# Altium schematic sheet P13 Configuration.SchDoc
size 420 x 297 mm
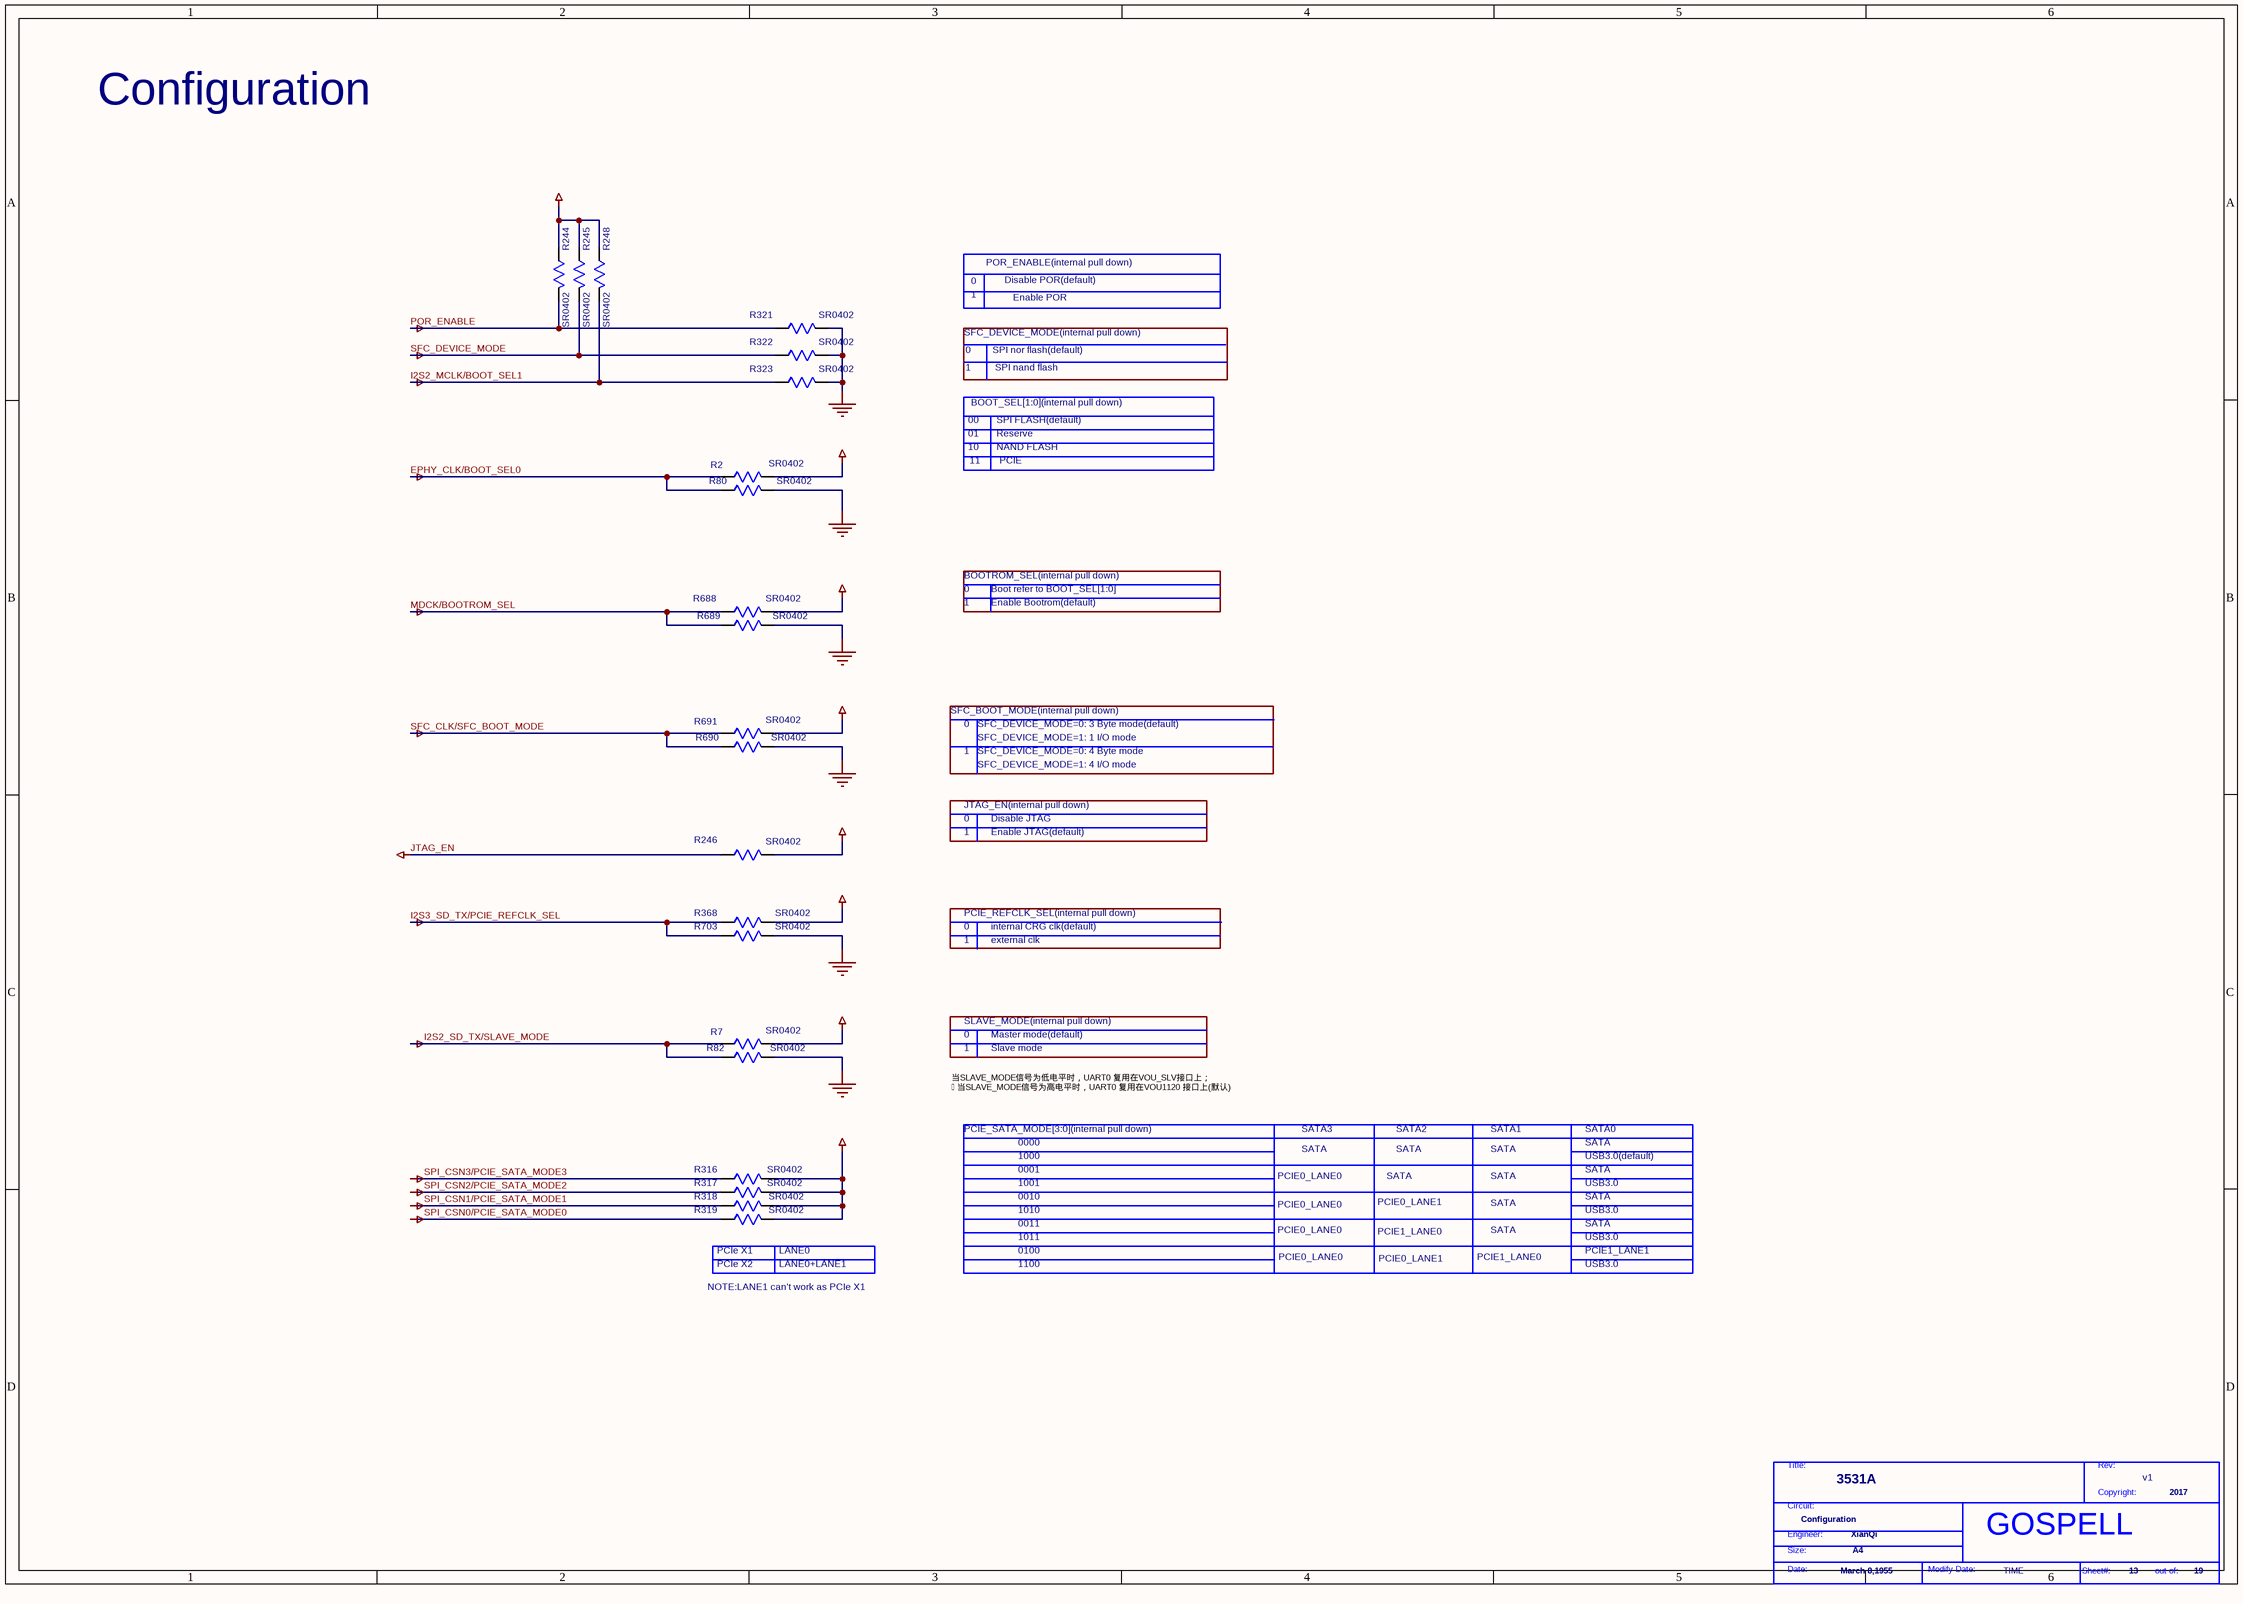
[diagram p0: P13 Configuration.SchDoc]

## Parts
*  Page Modify Date: TIME  Engineer: XianQi  Copyright: 2017  Title: 3531A  RevCode: v1  Page Size: A4  Page Create Date: March 8,1955  Page Number: 13  Page Count: 19  Doc: Configuration  (hidden comment: GOSPELL)  (graphical)
R2  SR0402  [SR0402]
R7  SR0402  [SR0402]
R80  SR0402  [SR0402]
R82  SR0402  [SR0402]
R244  SR0402  [SR0402]
R245  SR0402  [SR0402]
R246  SR0402  [SR0402]
R248  SR0402  [SR0402]
R316  SR0402  [SR0402]
R317  SR0402  [SR0402]
R318  SR0402  [SR0402]
R319  SR0402  [SR0402]
R321  SR0402  [SR0402]
R322  SR0402  [SR0402]
R323  SR0402  [SR0402]
R368  SR0402  [SR0402]
R688  SR0402  [SR0402]
R689  SR0402  [SR0402]
R690  SR0402  [SR0402]
R691  SR0402  [SR0402]
R703  SR0402  [SR0402]

## Nets
3V3: R2.2(B) R7.2(B) R244.1(A) R245.1(A) R246.2(B) R248.1(A) R316.2(B) R317.2(B) R318.2(B) R319.2(B) R368.2(B) R688.2(B) R691.2(B)
EPHY_CLK/BOOT_SEL0: R2.1(A) R80.1(A)
GND: R80.2(B) R82.2(B) R321.2(B) R322.2(B) R323.2(B) R689.2(B) R690.2(B) R703.2(B)
I2S2_MCLK/BOOT_SEL1: R248.2(B) R323.1(A)
I2S2_SD_TX/SLAVE_MODE: R7.1(A) R82.1(A)
I2S3_SD_TX/PCIE_REFCLK_SEL: R368.1(A) R703.1(A)
JTAG_EN: R246.1(A)
MDCK/BOOTROM_SEL: R688.1(A) R689.1(A)
POR_ENABLE: R244.2(B) R321.1(A)
SFC_CLK/SFC_BOOT_MODE: R690.1(A) R691.1(A)
SFC_DEVICE_MODE: R245.2(B) R322.1(A)
SPI_CSN0/PCIE_SATA_MODE0: R319.1(A)
SPI_CSN1/PCIE_SATA_MODE1: R318.1(A)
SPI_CSN2/PCIE_SATA_MODE2: R317.1(A)
SPI_CSN3/PCIE_SATA_MODE3: R316.1(A)

## Notes on the sheet
- Configuration
- 0
- 1
- POR_ENABLE(internal pull down)
- Disable POR(default)
- Enable POR
- SFC_DEVICE_MODE(internal pull down)
- SPI nor flash(default)
- SPI nand flash
- 10
- 01
- 00
- 11
- BOOT_SEL[1:0](internal pull down)
- NAND FLASH
- SPI FLASH(default)
- Reserve
- PCIE
- BOOTROM_SEL(internal pull down)
- Boot refer to BOOT_SEL[1:0]
- Enable Bootrom(default)
- SFC_BOOT_MODE(internal pull down)
- SFC_DEVICE_MODE=0: 3 Byte mode(default)
- SFC_DEVICE_MODE=1: 4 I/O mode
- SFC_DEVICE_MODE=0: 4 Byte mode
- SFC_DEVICE_MODE=1: 1 I/O mode
- JTAG_EN(internal pull down)
- Enable JTAG(default)
- Disable JTAG
- PCIE_REFCLK_SEL(internal pull down)
- internal CRG clk(default)
- external clk
- SLAVE_MODE(internal pull down)
- Slave mode
- Master mode(default)
- 当SLAVE_MODE信号为低电平时，UART0 复用在VOU_SLV接口上；
   当SLAVE_MODE信号为高电平时，UART0 复用在VOU1120 接口上(默认)
- PCIE_SATA_MODE[3:0](internal pull down)
- SATA3
- SATA2
- SATA1
- SATA0
- 1001
- 0001
- 0010
- 1000
- 0000
- PCIE0_LANE0
- SATA
- PCIE0_LANE1
- USB3.0(default)
- USB3.0
- PCIe X1
- PCIe X2
- LANE0+LANE1
- LANE0
- 1010
- 0011
- 1011
- 0100
- 1100
- PCIE1_LANE0
- PCIE1_LANE1
- NOTE:LANE1 can't work as PCIe X1
- (in symbol GOSPELL) Title:; Rev:; Copyright:; Circuit:; Engineer:; Size:; Date:; Modify Date:; Sheet#:; out of:

## Library data of the parts
R2 R80 R82 R246 R318 R319 R368 R689 R703 = R_1: PARTS: 1; LEVEL: STD; DEVICE: RK73B1ELTP472J; PINSWAP: (A,B); OriginalSymbolOrigin: (10,20); CODE: 7090793; %195%%232%%202%%246%: 片式厚膜电阻器-0.0625W-4700OHM-+/-5%-0402-BT; %182%%238%%182%%168%%185%%166%%194%%202%(W): 0.06; %215%%232%%214%%181%%212%%202%%208%%237%%198%%171%%178%%238%: +/-5%; COMPONENT_HIGH_MAX: 0.4MM; %208%%161%%192%%224%%195%%251%%179%%198%: 片式厚膜电阻器; PKG_TYPE: SR0402
R7 R316 R317 R688 R690 R691 = R_1: PARTS: 1; LEVEL: STD; DEVICE: RK73B1ELTP472J; PINSWAP: (A,B); OriginalSymbolOrigin: (10,20); %208%%161%%192%%224%%195%%251%%179%%198%: 片式厚膜电阻器; COMPONENT_HIGH_MAX: 0.4MM; %215%%232%%214%%181%%212%%202%%208%%237%%198%%171%%178%%238%: +/-5%; %182%%238%%182%%168%%185%%166%%194%%202%(W): 0.06; %195%%232%%202%%246%: 片式厚膜电阻器-0.0625W-4700OHM-+/-5%-0402-BT; CODE: 7090793; PKG_TYPE: SR0402
R244 R248 = R_1: PARTS: 1; LEVEL: STD; DEVICE: RK73H1ETTP1002F; PINSWAP: (A,B); OriginalSymbolOrigin: (10,20); CODE: 7090867; %195%%232%%202%%246%: 片式厚膜电阻器-0.0625W-10000OHM-+/-1%-0402-BT; %182%%238%%182%%168%%185%%166%%194%%202%(W): 0.06; %215%%232%%214%%181%%212%%202%%208%%237%%198%%171%%178%%238%: +/-1%; COMPONENT_HIGH_MAX: 0.4MM; %208%%161%%192%%224%%195%%251%%179%%198%: 片式厚膜电阻器; PKG_TYPE: SR0402
R245 = R_1: PARTS: 1; LEVEL: STD; DEVICE: RK73H1ETTP1002F; PINSWAP: (A,B); OriginalSymbolOrigin: (10,20); %208%%161%%192%%224%%195%%251%%179%%198%: 片式厚膜电阻器; COMPONENT_HIGH_MAX: 0.4MM; %215%%232%%214%%181%%212%%202%%208%%237%%198%%171%%178%%238%: +/-1%; %182%%238%%182%%168%%185%%166%%194%%202%(W): 0.06; %195%%232%%202%%246%: 片式厚膜电阻器-0.0625W-10000OHM-+/-1%-0402-BT; CODE: 7090867; PKG_TYPE: SR0402
R321 R323 = R_1: PARTS: 1; LEVEL: STD; DEVICE: RC0402FR_071KL; PINSWAP: (A,B); OriginalSymbolOrigin: (10,20); %208%%161%%192%%224%%195%%251%%179%%198%: 片式厚膜电阻器; COMPONENT_HIGH_MAX: 0.4MM; %215%%232%%214%%181%%212%%202%%208%%237%%198%%171%%178%%238%: +/-1%; %182%%238%%182%%168%%185%%166%%194%%202%(W): 0.06; %195%%232%%202%%246%: 片式厚膜电阻器-0.0625W-1000OHM-+/-1%-0402-BT; CODE: 7091282; PKG_TYPE: SR0402
R322 = R_1: PARTS: 1; LEVEL: STD; DEVICE: RC0402FR_071KL; PINSWAP: (A,B); OriginalSymbolOrigin: (10,20); CODE: 7091282; %195%%232%%202%%246%: 片式厚膜电阻器-0.0625W-1000OHM-+/-1%-0402-BT; %182%%238%%182%%168%%185%%166%%194%%202%(W): 0.06; %215%%232%%214%%181%%212%%202%%208%%237%%198%%171%%178%%238%: +/-1%; COMPONENT_HIGH_MAX: 0.4MM; %208%%161%%192%%224%%195%%251%%179%%198%: 片式厚膜电阻器; PKG_TYPE: SR0402